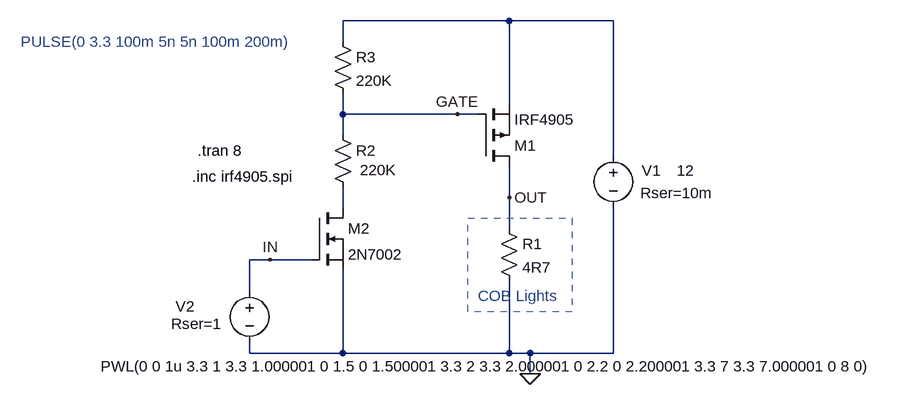
[diagram p0: schematic PChan-Mosfet-driver-original.asc]
PChan-Mosfet-driver-original.asc, the LTspice schematic file:
Version 4
SHEET 1 912 680
WIRE 336 -32 80 -32
WIRE 496 -32 336 -32
WIRE 80 0 80 -32
WIRE 336 96 336 -32
WIRE 80 112 80 80
WIRE 256 112 80 112
WIRE 288 112 256 112
WIRE 80 144 80 112
WIRE 496 176 496 -32
WIRE 336 240 336 192
WIRE 80 256 80 224
WIRE 336 288 336 240
WIRE -32 336 -64 336
WIRE 32 336 -32 336
WIRE -64 384 -64 336
WIRE -64 480 -64 464
WIRE 80 480 80 352
WIRE 80 480 -64 480
WIRE 336 480 336 368
WIRE 336 480 80 480
WIRE 368 480 336 480
WIRE 496 480 496 256
WIRE 496 480 368 480
WIRE 368 512 368 480
FLAG 368 512 0
FLAG -32 336 IN
FLAG 256 112 GATE
FLAG 336 240 OUT
SYMBOL res 320 272 R0
SYMATTR InstName R1
SYMATTR Value 4R7
SYMBOL res 64 128 R0
WINDOW 3 42 70 Left 2
SYMATTR Value 220K
SYMATTR InstName R2
SYMBOL nmos 32 256 R0
SYMATTR InstName M2
SYMATTR Value 2N7002
SYMBOL voltage 496 160 M0
WINDOW 123 0 0 Left 0
WINDOW 39 -154 73 Left 2
WINDOW 0 -73 39 Left 2
WINDOW 3 -125 39 Left 2
SYMATTR SpiceLine Rser=10m
SYMATTR InstName V1
SYMATTR Value 12
SYMBOL voltage -64 368 M0
WINDOW 123 0 0 Left 0
WINDOW 39 42 67 Left 2
WINDOW 0 84 40 Left 2
WINDOW 3 -973 132 Left 2
SYMATTR SpiceLine Rser=1
SYMATTR InstName V2
SYMATTR Value PWL(0 0 1u 3.3 1 3.3 1.000001 0 1.5 0 1.500001 3.3 2 3.3 2.000001 0 2.2 0 2.200001 3.3 7 3.3 7.000001 0 8 0)
SYMBOL res 64 -16 R0
SYMATTR InstName R3
SYMATTR Value 220K
SYMBOL pmos 288 192 M180
SYMATTR InstName M1
SYMATTR Value IRF4905
SYMATTR Prefix X
TEXT -152 208 Left 2 !.inc irf4905.spi
TEXT -144 168 Left 2 !.tran 8
TEXT 288 392 Left 2 ;COB Lights
TEXT -416 0 Left 2 ;PULSE(0 3.3 100m 5n 5n 100m 200m)
RECTANGLE Normal 432 416 272 272 2

The netlist it stands for:
* PChan-Mosfet-driver-original.asc
R1 OUT 0 4R7
R2 GATE N002 220K
M2 N002 IN 0 0 2N7002
V1 N001 0 12 Rser=10m
V2 IN 0 PWL(0 0 1u 3.3 1 3.3 1.000001 0 1.5 0 1.500001 3.3 2 3.3 2.000001 0 2.2 0 2.200001 3.3 7 3.3 7.000001 0 8 0) Rser=1
R3 N001 GATE 220K
XM1 OUT GATE N001 IRF4905  ; pins D G S
.model NMOS NMOS
.model PMOS PMOS
.lib standard.mos
.inc irf4905.spi
.tran 8
* COB Lights
* PULSE(0 3.3 100m 5n 5n 100m 200m)
.backanno
.end